# EAGLE design Talko_1_1 (EAGLE 7.2.0)
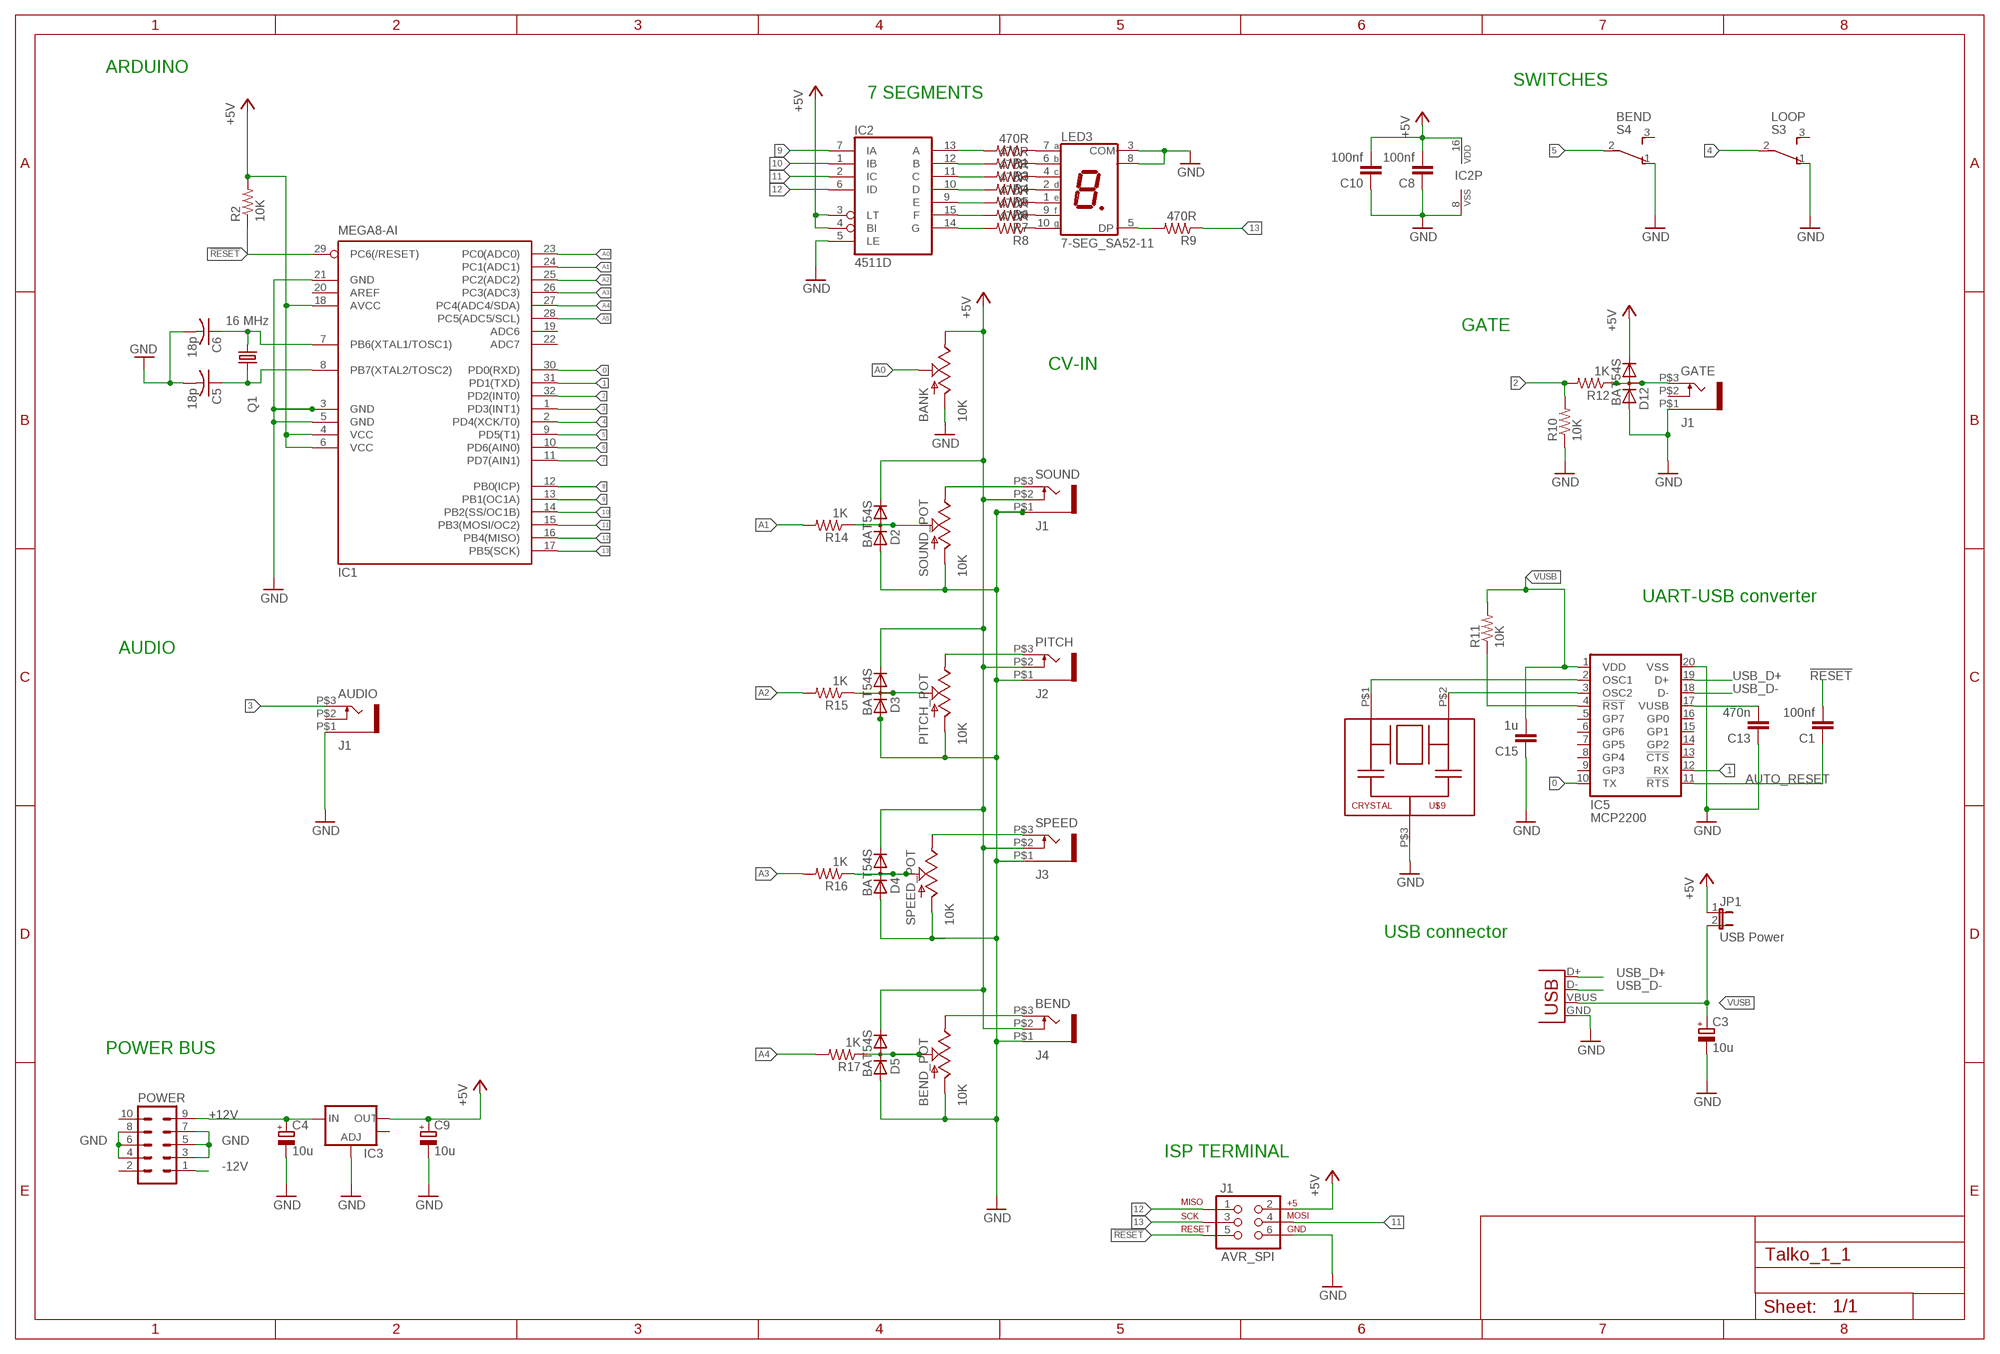
[diagram p0: schematic, sheet 1]

## Parts
AUDIO  J1  THONKICONN  [THONKICONN]
BANK  10K  POT  [ALPS_POT]
BEND  J4  THONKICONN  [THONKICONN]
BEND_POT  10K  POT  [ALPS_POT]
C1  100nf  C-EUC0805  [C0805]
C3  10u  CPOL-EUR/2012-12R  [R/2012-12R]
C4  10u  CPOL-EUR/2012-12R  [R/2012-12R]
C5  18p  C-USC0805K  [C0805K]
C6  18p  C-USC0805K  [C0805K]
C8  100nf  C-EUC0805  [C0805]
C9  10u  CPOL-EUR/2012-12R  [R/2012-12R]
C10  100nf  C-EUC0805  [C0805]
C13  470n  CAP0805  [0805]
C15  1u  CAP0805  [0805]
D2  BAT54S  DIODE_2CACA-SOT23  [SOT23]
D3  BAT54S  DIODE_2CACA-SOT23  [SOT23]
D4  BAT54S  DIODE_2CACA-SOT23  [SOT23]
D5  BAT54S  DIODE_2CACA-SOT23  [SOT23]
D12  BAT54S  DIODE_2CACA-SOT23  [SOT23]
GATE  J1  THONKICONN  [THONKICONN]
IC1  MEGA8-AI  [TQFP32-08]
IC2  4511D  [SO16]
IC3  V_REG_LM1117SOT223  [SOT223]
IC5  MCP2200  [SO20]
J1  AVR_SPI  AVR_SPI_PRG_62X3_LOCK  [2X3_LOCK]
JP1  USB Power  JP1E  [JP1]
LED3  7-SEG_SA52-11  [SA52-11]
PITCH  J2  THONKICONN  [THONKICONN]
PITCH_POT  10K  POT  [ALPS_POT]
POWER  10_PIN_HEADER  [MA05-2]
Q1  16 MHz  CRYSTALCTS406  [CTS406]
R1  470R  R-US_M0805  [M0805]
R2  10K  R-US_M0805  [M0805]
R3  470R  R-US_M0805  [M0805]
R4  470R  R-US_M0805  [M0805]
R5  470R  R-US_M0805  [M0805]
R6  470R  R-US_M0805  [M0805]
R7  470R  R-US_M0805  [M0805]
R8  470R  R-US_M0805  [M0805]
R9  470R  R-US_M0805  [M0805]
R10  10K  R-US_M0805  [M0805]
R11  10K  R-US_M0805  [M0805]
R12  1K  R-US_M0805  [M0805]
R14  1K  R-US_M0805  [M0805]
R15  1K  R-US_M0805  [M0805]
R16  1K  R-US_M0805  [M0805]
R17  1K  R-US_M0805  [M0805]
S3  LOOP  TL36PO  [TL3XPO]
S4  BEND  TL36PO  [TL3XPO]
SOUND  J1  THONKICONN  [THONKICONN]
SOUND_POT  10K  POT  [ALPS_POT]
SPEED  J3  THONKICONN  [THONKICONN]
SPEED_POT  10K  POT  [ALPS_POT]
U$9  CRYSTAL  [CRYSTAL]
X3  USB  USBPTH-VERTICAL  [USB-B-PTH-VERTICAL]

## Nets
0: IC1.30(PD0(RXD)) IC5.10(TX)
1: IC1.31(PD1(TXD)) IC5.12(RX)
2: IC1.32(PD2(INT0)) R10.2 R12.2
3: AUDIO.P$3 IC1.1(PD3(INT1))
4: IC1.2(PD4(XCK/T0)) S3.2(P)
5: IC1.9(PD5(T1)) S4.2(P)
6: IC1.10(PD6(AIN0))
7: IC1.11(PD7(AIN1))
8: IC1.12(PB0(ICP))
9: IC1.13(PB1(OC1A)) IC2.7(IA)
10: IC1.14(PB2(SS/OC1B)) IC2.1(IB)
11: IC1.15(PB3(MOSI/OC2)) IC2.2(IC) J1.4
12: IC1.16(PB4(MISO)) IC2.6(ID) J1.1
13: IC1.17(PB5(SCK)) J1.3 R9.1
!RESET: C1.2 IC1.29(PC6(/RESET)) J1.5 R2.1
+5V: BANK.P$1(E) BEND.P$2 C8.2 C9.+ C10.2 D2.2(C) D3.2(C) D4.2(C) D5.2(C) D12.2(C) IC1.4(VCC) IC1.6(VCC) IC1.18(AVCC) IC2.3(LT) IC2.4(BI) IC2.16(VDD) IC3.2(OUT) J1.2 JP1.1 PITCH.P$2 R2.2 SOUND.P$2 SPEED.P$2
+12V: C4.+ IC3.3(IN) POWER.9
-12V [power]: POWER.1
A0: BANK.P$2(S) IC1.23(PC0(ADC0))
A1: IC1.24(PC1(ADC1)) R14.2
A2: IC1.25(PC2(ADC2)) R15.2
A3: IC1.26(PC3(ADC3)) R16.2
A4: IC1.27(PC4(ADC4/SDA)) R17.2
A5: IC1.28(PC5(ADC5/SCL))
AUTO_RESET: C1.1 IC5.11(!RTS)
GND: AUDIO.P$1 BANK.P$3(A) BEND.P$1 BEND_POT.P$3(A) C3.- C4.- C5.2 C6.2 C8.1 C9.- C10.1 C13.1 C15.1 D2.1(A) D3.1(A) D4.1(A) D5.1(A) D12.1(A) GATE.P$1 IC1.3(GND) IC1.5(GND) IC1.21(GND) IC2.5(LE) IC2.8(VSS) IC3.1(ADJ) IC5.20(VSS) J1.6 LED3.3(COM) LED3.8(COM) PITCH.P$1 PITCH_POT.P$3(A) POWER.3 POWER.4 POWER.5 POWER.6 POWER.7 POWER.8 R10.1 S3.1(O) S4.1(O) SOUND.P$1 SOUND_POT.P$3(A) SPEED.P$1 SPEED_POT.P$3(A) U$9.P$3 X3.GND
N$1: D12.3(AC) GATE.P$3 R12.1
N$2: SOUND.P$3 SOUND_POT.P$1(E)
N$3: C5.1 IC1.8(PB7(XTAL2/TOSC2)) Q1.1
N$4: LED3.5(DP) R9.2
N$5: PITCH.P$3 PITCH_POT.P$1(E)
N$7: SPEED.P$3 SPEED_POT.P$1(E)
N$8: IC2.13(A) R1.2
N$9: D2.3(AC) R14.1 SOUND_POT.P$2(S)
N$10: LED3.7(A) R1.1
N$11: IC5.3(OSC2) U$9.P$2
N$12: C6.1 IC1.7(PB6(XTAL1/TOSC1)) Q1.3
N$15: IC2.12(B) R3.2
N$16: LED3.6(B) R3.1
N$17: IC2.11(C) R4.2
N$18: LED3.4(C) R4.1
N$19: IC2.10(D) R5.2
N$20: LED3.2(D) R5.1
N$21: IC2.9(E) R6.2
N$22: LED3.1(E) R6.1
N$23: IC2.15(F) R7.2
N$24: LED3.9(F) R7.1
N$25: IC2.14(G) R8.2
N$26: LED3.10(G) R8.1
N$27: IC5.2(OSC1) U$9.P$1
N$28: IC5.4(!RST) R11.1
N$29: C13.2 IC5.17(VUSB)
N$30: D4.3(AC) R16.1 SPEED_POT.P$2(S)
N$31: D3.3(AC) PITCH_POT.P$2(S) R15.1
N$33: BEND_POT.P$2(S) D5.3(AC) R17.1
N$36: BEND.P$3 BEND_POT.P$1(E)
USB_D+: IC5.19(D+) X3.D+
USB_D-: IC5.18(D-) X3.D-
VUSB: C3.+ C15.2 IC5.1(VDD) JP1.2 R11.2 X3.VBUS
Unconnected: AUDIO.P$2 GATE.P$2 IC1.19(ADC6) IC1.20(AREF) IC1.22(ADC7) IC3.4(OUT) IC5.5(GP7) IC5.6(GP6) IC5.7(GP5) IC5.8(GP4) IC5.9(GP3) IC5.13(!CTS) IC5.14(GP2) IC5.15(GP1) IC5.16(GP0) POWER.2 POWER.10 S3.3(S) S4.3(S)

## Notes on the sheet
- ARDUINO
- SWITCHES
- 7 SEGMENTS
- GATE
- CV-IN
- UART-USB converter
- AUDIO
- USB connector
- POWER BUS
- ISP TERMINAL

## Library data of the parts
AUDIO BEND GATE PITCH SOUND SPEED = thonkiconn:THONKICONN
BANK BEND_POT PITCH_POT SOUND_POT SPEED_POT = SparkFun-Electromechanical:POT; OC_FARNELL: 1769829; OC_MOUSER: 688-RK09L1140A2U
C1 C8 C10 = resistor:C-EU: CAPACITOR, European symbol; OC_MOUSER: 77-VJ0805V104MXBPBC
C3 C4 C9 = rcl:CPOL-EU: POLARIZED CAPACITOR, European symbol; OC_FARNELL: 1236657; OC_MOUSER: 581-F981C106MSAAS1
C5 C6 = rcl:C-US: CAPACITOR, American symbol; OC_MOUSER: 77-VJ0805A180GXQCBC
C13 = SparkFun:CAP: Capacitor Standard 0603 ceramic capacitor, and 0.1" leaded capacitor.; OC_FARNELL: 1457660; OC_MOUSER: 77-VJ0805Y474KXQTBC
C15 = SparkFun:CAP: Capacitor Standard 0603 ceramic capacitor, and 0.1" leaded capacitor.; OC_FARNELL: 2112910; OC_MOUSER: 77-VJ0805Y105KXQTBC
D2-D5 D12 = diode:DIODE_2CACA-: 2 Diodes - Cathode-Anode|Cathode-Anode; OC_MOUSER: 78-BAT54S-E3-08
IC1 = atmel:MEGA8: MICROCONTROLLER 8 Kbytes FLASH, 1 kbytes SRAM, 512 bytes EEPROM, USART, 6-channel 10 bit ADC, 2-channel 8 bit ADC Pin compatible with Atmega48, ATMega88, ATMega168 Source: avr.lbr; MPN: ATMEGA8-16AU; OC_FARNELL: 9171371; OC_MOUSER: 556-ATMEGA328P-AU; OC_NEWARK: 73M8863
IC2 = 45xx:4511: BCD to 7-segment LATCH/DECODER/DRIVER; OC_MOUSER: 863-MC14511BDG
IC3 = SparkFun-PowerIC:V_REG_LM1117: Voltage Regulator LM1117 Standard adjustable voltage regulator but in SMD form. Spark Fun Electronics SKU : COM-00595; OC_MOUSER: 621-AZ1117H-5.0TRE
IC5 = SteveMarple:MCP2200: MCP2200 Microchip USB-UART interface.; OC_FARNELL: 1781148; OC_MOUSER: 579-MCP2200-I/SO
J1 = SparkFun-Connectors:AVR_SPI_PRG_6: AVR ISP 6 Pin This is the reduced ISP connector for AVR programming. Common on Arduino. This footprint will take up less PCB space and can be used with a 10-pin to 6-pin adapter such as SKU: BOB-08508; OC_MOUSER: 571-826925-3
JP1 = jumper:JP1E: JUMPER; OC_MOUSER: 571-826646-2
LED3 = display-kingbright:7-SEG_: Kingbright 14.2mm (0.56 INCH) SINGLE DIGIT NUMERIC DUISPLAY Source: SA56-11EWA(Ver1189471036.pdf; OC_FARNELL: 1168602; OC_MOUSER: 604-SC52-11SRWA; OC_NEWARK: unknown
POWER = TomW:10_PIN_HEADER: PIN HEADER; OC_FARNELL: unknown; OC_MOUSER: 571-5-146258-5; OC_NEWARK: unknown
Q1 = crystal:CRYSTAL: CRYSTAL; OC_FARNELL: unknown; OC_MOUSER: 774-406C35S16M00000; OC_NEWARK: unknown
R1 R3-R9 = resistor:R-US_: RESISTOR, American symbol; OC_MOUSER: 754-RR1220P-471D
R2 R10 R11 = resistor:R-US_: RESISTOR, American symbol; OC_MOUSER: 754-RR1220P-103D
R12 R14-R17 = resistor:R-US_: RESISTOR, American symbol; OC_MOUSER: 71-TNPW08051K00BEEA
S3 S4 = switch:TL36PO: TINY SWITCH ON - ON Source: http://www2.produktinfo.conrad.com/datenblaetter/700000-724999/705152-da-01-de-Subminiaturschalter_TL_36YO.pdf; OC_FARNELL: 9472967; OC_MOUSER: 612-200ASP1T1A1M2R
U$9 = 57466:CRYSTAL; OC_FARNELL: 1218535; OC_MOUSER: 581-PBRC12.00HR50X
X3 = SteveMarple:USB: USB Connectors USB-B-PTH is fully proven SKU : PRT-00139 USB-miniB is fully proven SKU : PRT-00587 USB-A-PCB is untested. USB-A-H is throughly reviewed, but untested. Spark Fun Electronics SKU : PRT-00437 USB-B-SMT is throughly reviewed, but untested. Needs silkscreen touching up. USB-A-S has not been used/tested USB-MB-H has not been used/tested; OC_MOUSER: 855-M701-330442

## Net classes
0 default: width 0.254 mm
1 power: width 0.61 mm
2 ground: width 0.61 mm

## Board
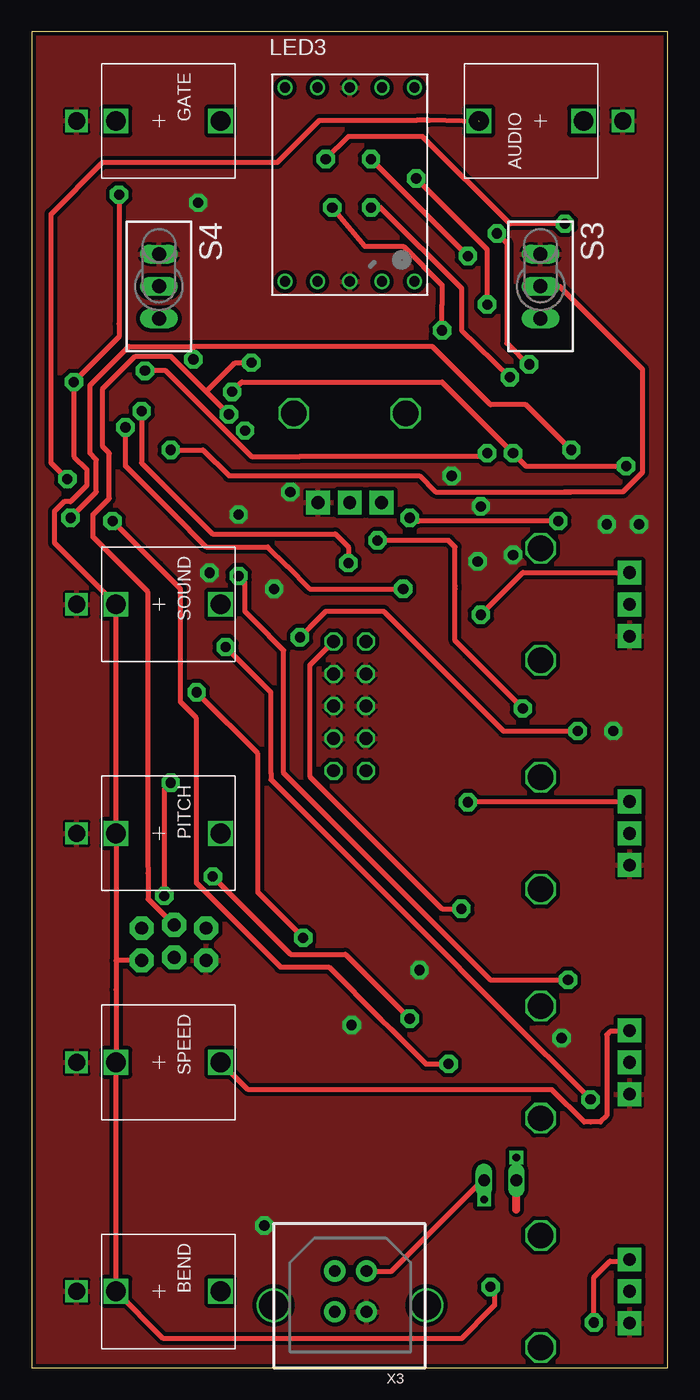
[diagram p1: board, top side]
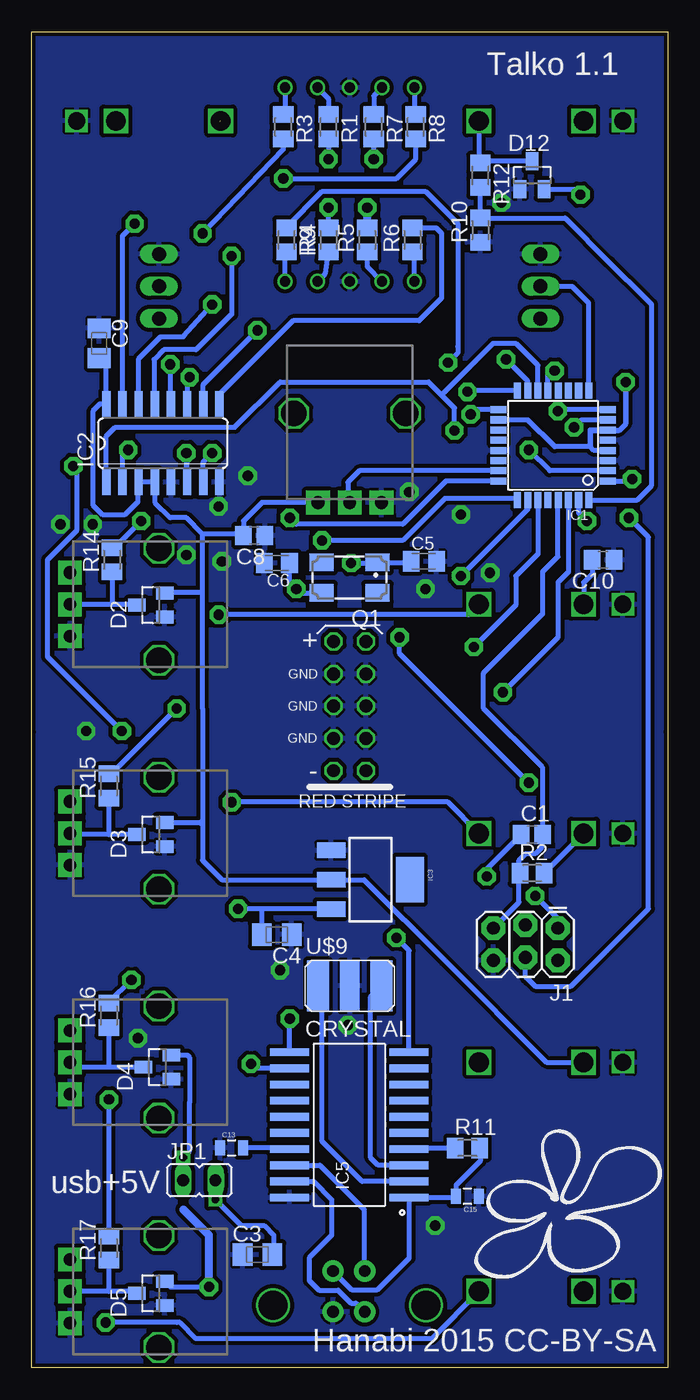
[diagram p2: board, bottom side, seen from below]

Size 50 x 105 mm. Coordinates in mm from the lower left corner, seen from the top.
Outline: 0,0 50,0 50,50 50,105 0,105 0,50 0,0
Copper layers (1*16): Top 0.035mm / dielectric 1.5mm / Bottom 0.035mm
Design rules "PCB-POOL Standard": minimum track width 0.15mm, minimum drill 0.3mm, track to track 0.15mm, track to pad 0.15mm, pad to pad 0.15mm, via to via 0.15mm, smd to smd 0.15mm, copper to edge 0.3mm, drill to drill 0.2mm, minimum pad ring 0.2mm, minimum via ring 0.15mm, stop-mask expansion 0.075mm, vias tented up to drill 0mil, thermal gap 0.2mm

### Footprints (pad centres in the part's own frame; a part is rotated, then mirrored left to right if it is on the bottom)
THONKICONN = drill 1.35 square: P$1 0,-6.48 | drill 1.55 square: P$2 0,-3.38; P$3 0,4.84
ALPS_POT = drill 1 pad 1.88 square: P$1 7,-2.5; P$2 7,0; P$3 7,2.5 | drill 2 octagon: P$4 0,-4.4; P$5 0,4.4
C0805 = smd 1.3 x 1.5: 1 -0.85,0; 2 0.85,0
R/2012-12R = smd 1.55 x 1.8: + 1.175,0; - -1.175,0
C0805K = smd 1.3 x 1.6: 1 -1,0; 2 1,0
0805 = smd 0.8 x 1.2: 1 -0.9,0; 2 0.9,0
SOT23 = smd 1 x 1.4: 1 -0.95,-1.1; 2 0.95,-1.1; 3 0,1.1
TQFP32-08 = smd 1.27 x 0.559: 1 -4.293,2.8; 2 -4.293,2; 3 -4.293,1.2; 4 -4.293,0.4; 5 -4.293,-0.4; 6 -4.293,-1.2; 7 -4.293,-2; 8 -4.293,-2.8; 17 4.293,-2.8; 18 4.293,-2; 19 4.293,-1.2; 20 4.293,-0.4; 21 4.293,0.4; 22 4.293,1.2; 23 4.293,2; 24 4.293,2.8 | smd 0.559 x 1.27: 9 -2.8,-4.293; 10 -2,-4.293; 11 -1.2,-4.293; 12 -0.4,-4.293; 13 0.4,-4.293; 14 1.2,-4.293; 15 2,-4.293; 16 2.8,-4.293; 25 2.8,4.293; 26 2,4.293; 27 1.2,4.293; 28 0.4,4.293; 29 -0.4,4.293; 30 -1.2,4.293; 31 -2,4.293; 32 -2.8,4.293
SO16 = smd 0.66 x 2.032: 1 -4.445,-3.073; 2 -3.175,-3.073; 3 -1.905,-3.073; 4 -0.635,-3.073; 5 0.635,-3.073; 6 1.905,-3.073; 7 3.175,-3.073; 8 4.445,-3.073; 9 4.445,3.073; 10 3.175,3.073; 11 1.905,3.073; 12 0.635,3.073; 13 -0.635,3.073; 14 -1.905,3.073; 15 -3.175,3.073; 16 -4.445,3.073
SOT223 = smd 1.219 x 2.235: 1 -2.311,-3.099; 2 0,-3.099; 3 2.311,-3.099 | smd 3.6 x 2.2: 4 0,3.099
SO20 = smd 0.61 x 3.048: 1 -5.715,-4.699; 2 -4.445,-4.699; 3 -3.175,-4.699; 4 -1.905,-4.699; 5 -0.635,-4.699; 6 0.635,-4.699; 7 1.905,-4.699; 8 3.175,-4.699; 9 4.445,-4.699; 10 5.715,-4.699; 11 5.715,4.699; 12 4.445,4.699; 13 3.175,4.699; 14 1.905,4.699; 15 0.635,4.699; 16 -0.635,4.699; 17 -1.905,4.699; 18 -3.175,4.699; 19 -4.445,4.699; 20 -5.715,4.699
2X3_LOCK = drill 1.016 pad 1.88 octagon: 1 0,0; 2 0,2.54; 3 2.54,-0.254; 4 2.54,2.286; 5 5.08,0; 6 5.08,2.54
JP1 = drill 0.914 long: 1 0,-1.27; 2 0,1.27
SA52-11 = drill 0.8: 1 -5.08,-7.62; 2 -2.54,-7.62; 3 0,-7.62; 4 2.54,-7.62; 5 5.08,-7.62; 6 5.08,7.62; 7 2.54,7.62; 8 0,7.62; 9 -2.54,7.62; 10 -5.08,7.62
MA05-2 = drill 1.016 octagon: 1 -5.08,-1.27; 2 -5.08,1.27; 3 -2.54,-1.27; 4 -2.54,1.27; 5 0,-1.27; 6 0,1.27; 7 2.54,-1.27; 8 2.54,1.27; 9 5.08,-1.27; 10 5.08,1.27
CTS406 = smd 1.9 x 1.4: 1 -2.2,-1.2; 2 2.2,-1.2; 3 2.2,1.2; 4 -2.2,1.2
M0805 = smd 1.3 x 1.6: 1 -0.95,0; 2 0.95,0
TL3XPO = drill 1.1 pad 1.422 long: 1 -2.54,0; 2 0,0; 3 2.54,0
CRYSTAL = smd 1.7 x 4: P$1 -2.5,0; P$2 2.5,0 | smd 1.5 x 4: P$3 0,0
USB-B-PTH-VERTICAL = drill 0.914 pad 1.676: D+ 4.826,4.394; D- 4.826,7.595; GND 7.315,4.394; VBUS 7.315,7.595 | drill 2.286: P$1 0,4.902; P$2 12.04,4.902

### Placement (x,y rotation side)
AUDIO  40,98 90 top
BANK  25,75 270 bottom
BEND  10,6 270 top
BEND_POT  40,6 180 bottom
C1  10.67,41.91 0 bottom
C3  32.26,8.89 0 bottom
C4  30.73,34.04 180 bottom
C5  19.18,63.37 0 bottom
C6  30.73,63.25 180 bottom
C8  32.51,65.41 180 bottom
C9  44.7,80.52 270 bottom
C10  5.08,63.5 180 bottom
C13  34.29,17.27 0 bottom
C15  15.75,13.46 180 bottom
D2  40.64,59.94 90 bottom
D3  40.64,41.91 90 bottom
D4  40.13,23.62 90 bottom
D5  40.64,5.84 90 bottom
D12  10.67,93.73 0 bottom
GATE  10,98 270 top
IC1  9.01,72.5 180 bottom
IC2  39.69,72.67 0 bottom
IC3  23.37,38.35 270 bottom
IC5  25.04,19.08 90 bottom
J1  8.64,34.54 180 bottom
JP1  36.83,14.73 270 bottom
LED3  25,93 0 top
PITCH  10,42 270 top
PITCH_POT  40,42 180 bottom
POWER  25,52 90 bottom
Q1  25.02,62.1 180 bottom
R1  26.67,97.54 270 bottom
R2  10.67,38.86 0 bottom
R3  30.23,97.54 270 bottom
R4  26.67,88.65 90 bottom
R5  23.62,88.65 90 bottom
R6  20.07,88.65 90 bottom
R7  23.11,97.54 270 bottom
R8  19.81,97.54 270 bottom
R9  29.97,88.65 270 bottom
R10  14.73,89.41 90 bottom
R11  15.75,17.27 0 bottom
R12  14.73,93.73 270 bottom
R14  43.69,63.5 90 bottom
R15  43.94,45.72 90 bottom
R16  43.94,27.69 90 bottom
R17  43.94,9.4 90 bottom
S3  40,85 270 top
S4  10,85 270 top
SOUND  10,60 270 top
SOUND_POT  40,60 180 bottom
SPEED  10,24 270 top
SPEED_POT  40,24 180 bottom
U$1  [LOGO_HANABI]  16.51,6.35 0 bottom
U$9  25,30 0 bottom
X3  19,0 0 top

### Tracks (layer width: path | path; a pad name or v marks a point on that pad's centre or on a via)
0  (via drill 0.8)
  Top 0.406: v12.95,53.09 13.21,52.83 17.78,48.26 17.78,37.34 21.08,34.04 v21.34,33.78
  Bottom 0.406: IC1.30 7.81,65.47 7.81,62.55 8.64,61.72 8.64,57.4 v12.95,53.09 | IC5.10 20.34,32.78 v21.34,33.78
1  (via drill 0.8)
  Top 0.406: 11.68,61.21 11.56,61.34 | 11.56,61.34 9.91,62.99 v6.35,66.55 | 11.68,61.21 11.68,52.32 12.95,51.05 12.95,42.93 12.95,38.1 13.72,37.34 17.53,33.53 19.56,31.5 23.37,31.5 27.43,27.43 28.19,26.67 30.99,23.88 v32.77,23.88 | 11.68,61.21 11.56,61.34
  Bottom 0.406: IC1.31 7.01,67.21 v6.35,66.55 | IC5.12 32.42,23.53 v32.77,23.88
2
  Bottom 0.406: R12.2 R10.2 8.06,90.36 4.57,86.87 1.78,84.07 1.27,83.57 1.27,78.99 1.27,69.34 2.41,68.2 IC1.32
3  (via drill 0.8)  (1 unrouted)
  Top 0.406: v2.79,69.85 1.52,71.12 1.52,90.68 5.59,94.74 19.3,94.74 22.61,98.04 30.23,98.04 31.24,98.04 35.18,97.92 35.05,97.92
  Bottom 0.406: IC1.1 2.95,69.7 v2.79,69.85
4  (via drill 0.8)
  Top 0.406: S3.2 41.49,85 43.94,82.55 48.01,78.49 48.01,70.36 46.48,68.83 41.91,68.83 | v10.92,72.14 13.46,72.14 15.49,70.1 30.48,70.1 31.75,68.83 41.91,68.83 | 41.91,68.83 42.42,68.83
  Bottom 0.406: IC1.2 9.28,70.5 v10.92,72.14
5
  Bottom 0.406: S4.2 7.53,85 6.35,83.82 6.21,83.68 IC1.9
9  (via drill 0.8)
  Top 0.406: v35.81,71.88 35.56,71.63 21.08,71.63 17.27,71.63 16,72.9 10.54,78.36 v8.89,78.36
  Bottom 0.406: IC2.7 36.52,71.18 v35.81,71.88 | IC1.13 9.41,78.22 v8.89,78.36
10  (via drill 0.8)
  Bottom 0.406: IC2.1 44.13,73.21 43.43,73.91 34.04,73.91 30.48,77.47 18.8,77.47 17.78,76.45 | 17.78,76.45 16.76,75.44 | v16.76,73.66 16.76,74.17 16.76,75.44 | 16.76,75.44 17.78,76.45 | 17.78,76.45 13.72,80.52 11.94,80.52 11.43,80.01 10.21,78.79 IC1.14
11  (via drill 0.8)
  Top 0.406: v42.42,72.14 42.16,72.39 41.4,73.15 38.86,75.69 36.07,75.69 31.5,80.26 16,80.26 12.7,80.26 | v3.05,66.8 4.32,68.07 5.08,68.83 5.08,71.37 4.57,71.88 4.57,77.22 4.83,77.47 7.62,80.26 12.7,80.26 | v12.7,79.25 12.7,80.26
  Bottom 0.406: IC2.2 42.87,71.69 v42.42,72.14 | v3.05,66.8 1.52,65.28 1.52,36.07 7.62,29.97 10.41,29.97 10.92,30.48 11.18,30.73 J1.4 | IC1.15 11.01,77.56 v12.7,79.25
12  (via drill 0.8)
  Top 0.406: v37.85,71.88 36.58,73.15 | 36.58,73.15 v37.85,71.88 | 36.58,73.15 v37.85,71.88 | v37.85,71.88 38.86,70.87 | 38.86,70.87 46.48,70.87 | 46.48,70.87 v46.74,70.87 | 36.58,73.15 v37.85,71.88 | v37.85,71.88 38.86,70.87 | 38.86,70.87 46.48,70.87 | 46.48,70.87 v46.74,70.87 | v21.08,57.4 21.84,58.17 23.11,59.44 27.69,59.44 37.08,50.04 40.89,50.04 41.15,50.04 v42.93,50.04 | v10.92,45.97 10.41,45.47 v10.41,37.08 | v15.75,76.71 16.51,77.47 32.26,77.47 36.58,73.15 | v37.85,71.88 38.86,70.87 | 38.86,70.87 v46.74,70.87
  Bottom 0.406: IC1.16 15.41,76.79 v15.75,76.71 | 46.48,70.61 v46.74,70.87 46.48,70.61 | 46.48,70.61 46.48,65.79 | v10.41,37.08 8.64,35.31 J1.1 | v10.92,45.97 21.08,56.13 v21.08,57.4 | 46.48,70.61 46.48,65.79 | 46.48,65.79 48.77,63.5 48.77,55.88 v42.93,50.04 | IC2.6 37.78,71.18 v37.85,71.88 37.85,69.66 IC2.6
13  (via drill 0.8)
  Top 0.406: v15.49,74.93 14.48,75.95 13.72,76.71 | 13.72,76.71 16,78.99 v17.27,78.99 | 13.72,76.71 13.46,76.96 12.45,77.98 10.92,79.5 8.13,79.5 5.59,76.96 5.59,72.39 6.1,71.88 6.1,68.33 4.83,67.06 4.83,65.28 7.62,62.48 9.14,60.96 9.14,39.37 9.14,38.86 9.14,36.83 J1.3
  Bottom 0.406: R9.1 29.97,89.66 27.18,92.46 19.05,92.46 16.51,89.92 16.51,80.26 16.51,79.76 v17.27,78.99 | IC1.17 15.13,75.3 | 15.13,75.3 v15.49,74.93 15.13,75.3
!RESET
  Bottom 0.406: J1.5 11.68,36.58 11.68,38.35 11.68,38.8 R2.1 11.68,38.93 11.68,39.88 11.18,40.39 10.67,40.39 10.41,40.39 9.91,40.89 9.91,41.82 C1.2 9.82,47.16 9.91,47.24 14.48,51.82 14.48,54.61 9.82,59.27 9.82,62.57 8.64,63.75 8.64,68.18 IC1.29
+5V  (via drill 0.6, 0.8)
  Top 0.406: 6.62,32 PITCH.P$2 SOUND.P$2 1.78,64.84 1.78,67.31 2.54,68.07 3.05,68.07 4.32,69.34 4.32,70.61 3.3,71.63 v3.3,77.47 6.86,81.03 6.86,82.04 v6.86,92.2 | 6.62,32 6.62,29.72 6.62,24.64 BEND.P$2 10.33,2.29 33.78,2.29 36.07,4.57 36.39,4.89 36.39,6.03 v36.07,6.35 | 38.1,12.45 JP1.1 v38.1,16.51 | J1.2 6.62,32
  Top 0.61: 6.62,24.64 SPEED.P$2 | 38.1,12.45 JP1.1
  Bottom 0.406: C9.+ 44.45,79.6 44.45,79.76 44.13,79.56 IC2.16 44.66,75.74 45.21,75.18 45.21,67.82 44.45,67.06 42.67,67.06 41.66,68.07 41.66,69.53 IC2.3 IC2.4 40.33,68.01 39.12,66.8 37.85,66.8 36.58,65.53 | 38.1,12.45 36.07,10.41 v36.07,6.35 39.1,6.35 D5.2 | R2.2 6.62,41.96 PITCH.P$2 | D12.2 7.28,92.63 v6.86,92.2 | SPEED.P$2 9.52,24 17.53,32 23.88,38.35 IC3.2 35.05,38.35 35.18,38.48 36.58,39.88 36.58,42.67 | BANK.P$1 31.91,68 33.36,66.55 C8.2 | 6.1,73.7 IC1.6 4.68,73.66 3.81,73.66 | IC1.4 5.8,72.1 | 5.8,72.1 6.1,72.39 | 6.1,72.39 6.1,73.44 6.1,73.66 | 6.1,73.66 6.1,73.7 | 3.3,74.17 v3.3,77.47 3.3,74.17 | 3.3,74.17 3.81,73.66 | C10.2 5.93,62.4 6.6,61.72 6.6,60.02 SOUND.P$2 | 5.8,72.1 6.1,72.39 | 6.1,72.39 6.1,73.66 | 6.1,73.66 3.81,73.66 | 3.81,73.66 3.3,74.17 | 6.1,73.7 6.1,72.39 | 6.1,72.39 8.89,72.39 11,74.5 IC1.18 | v38.1,16.51 37.59,17.02 37.59,20.83 37.59,24.38 37.78,24.57 D4.2 | 33.27,65.49 C8.2 | C8.2 33.49,65.53 35.05,65.53 35.81,65.53 36.58,65.53 | 36.58,42.67 36.58,51.82 36.58,60.96 | D3.2 36.76,42.86 36.58,42.67 | 36.58,60.96 36.58,65.02 36.58,65.53 | D2.2 39.47,60.96 36.58,60.96
  Bottom 0.61: v36.07,6.35 36.07,10.41 38.1,12.45
+12V  (via drill 0.8)
  Top 0.406: POWER.9 21.84,55.19 21.84,46.48 32.26,36.07 v33.78,36.07
  Bottom 0.406: IC3.3 32,36.04 | 32,36.04 33.76,36.04 v33.78,36.07 | C4.+ 31.91,35.95 32,36.04
A0
  Bottom 0.406: IC1.23 24.24,70.5 25.15,69.6 25.15,68.15 BANK.P$2
A1  (via drill 0.8)
  Top 0.406: v41.4,66.55 30.48,66.55 29.97,66.55 v29.72,66.8
  Bottom 0.406: 43.75,64.7 R14.2 43.69,64.26 v41.4,66.55 | IC1.24 17.42,69.7 20.83,66.29 29.21,66.29 v29.72,66.8
A2  (via drill 0.8)
  Top 0.406: v27.18,65.02 32.77,65.02 33.27,64.52 33.27,61.47 33.27,61.21 33.27,57.15 34.29,56.13 v38.61,51.82
  Bottom 0.406: IC1.25 11.93,68.33 17.53,68.33 20.83,65.02 v27.18,65.02 | v38.61,51.82 43.75,46.67 R15.2
A3  (via drill 0.8)
  Top 0.406: v16.26,62.23 16.76,61.72 16.76,61.21 16.76,59.44 17.53,58.67 19.81,56.39 19.81,46.74 36.07,30.48 42.1,30.48 | 42.1,30.48 42.16,30.67 42.1,30.48 | 42.1,30.48 v42.16,30.48
  Bottom 0.406: IC1.26 11.01,67.48 v16.26,62.23 | v42.16,30.48 43.94,28.7 R16.2
A4  (via drill 0.8)
  Top 0.406: v43.94,21.08 37.08,27.94 30.23,34.8 18.8,46.23 18.8,46.74 18.8,53.09 v15.24,56.64
  Bottom 0.406: IC1.27 10.21,63.96 11.94,62.23 11.94,59.94 v15.24,56.64 | v43.94,21.08 R17.2
AUTO_RESET  (via drill 0.8)
  Top 0.406: v14.22,38.61 20.34,32.49 24.66,32.49 v29.72,27.43
  Bottom 0.406: v14.22,38.61 14.22,39.2 C1.1 | IC5.11 29.74,27.41 v29.72,27.43
GND  (via drill 0.8)
  other vias: 25.15,26.92 13.08,91.57 30.48,31.24 41.66,25.91 18.29,11.18 37.85,63.88 45.72,50.04 47.75,66.29 33.02,70.1 13.97,62.48 20.32,68.83 16.26,67.06 35.31,67.69 45.21,66.29 19.05,61.21 35.05,63.37
  pour Top (isolate 0.305): 0,106.68 50.04,106.68 50.04,0 0,0
  pour Bottom (isolate 0.305): 0,105.66 49.78,105.66 50.04,0 0,0
N$1
  Bottom 0.406: D12.3 14.33,94.83 R12.1 14.84,94.53 GATE.P$3
N$2  (via drill 0.8)
  Top 0.406: v35.31,59.18 38.62,62.5 SOUND_POT.P$1
  Bottom 0.406: SOUND.P$3 15.66,59.18 v35.31,59.18
N$3  (via drill 0.8)
  Top 0.406: v8.64,75.18 8.64,71.12 14.22,65.53 23.88,65.53 24.38,65.02 24.89,64.52 v24.89,63.25
  Bottom 0.406: IC1.8 8.52,75.3 v8.64,75.18 | v24.89,63.25 22.88,63.25 Q1.1 20.36,63.3 C5.1
N$4
  Bottom 0.406: LED3.5 30.08,87.7 R9.2
N$5  (via drill 0.8)
  Top 0.406: v34.29,44.45 34.34,44.5 PITCH_POT.P$1
  Bottom 0.406: 46.95,44.45 PITCH_POT.P$1 | PITCH.P$3 17.29,44.45 v34.29,44.45
N$7
  Top 0.406: SPEED_POT.P$1 46.92,26.42 45.47,26.42 45.21,26.16 45.21,19.81 44.7,19.3 43.94,19.3 43.43,19.3 40.89,21.84 17.02,21.84 14.86,24 SPEED.P$3
N$8  (via drill 0.8)
  Top 0.406: v26.67,95 v34.29,87.38
  Bottom 0.406: R1.2 v26.67,95 | v34.29,87.38 34.29,82.8 37.08,80.01 39.62,80.01 40.39,79.25 40.39,75.8 IC2.13
N$9
  Bottom 0.406: D2.3 41.94,60 43.69,60 | 43.69,60 SOUND_POT.P$2 | R14.1 43.69,60
N$10
  Bottom 0.406: LED3.7 26.67,99.75 R1.1
N$11
  Bottom 0.406: IC5.3 22.77,15.91 23.37,16.51 23.37,29.13 U$9.P$2
N$12  (via drill 0.8)
  Top 0.406: v7.37,73.91 7.37,70.87 11.04,67.2 13.72,64.52 18.54,64.52 20.07,62.99 21.84,61.21 v29.21,61.21
  Bottom 0.406: IC1.7 6.78,74.5 v7.37,73.91 | C6.1 29.73,61.74 v29.21,61.21 28.9,60.9 Q1.3
N$15  (via drill 0.8)
  Top 0.406: v36.58,89.15 37.34,88.39 37.34,80.52 39.12,78.74 v39.12,78.87
  Bottom 0.406: R3.2 30.23,95.76 v36.58,89.15 | v39.12,78.87 39.12,75.8 IC2.12
N$16
  Bottom 0.406: LED3.6 30.08,98.49 R3.1
N$17  (via drill 0.8)
  Top 0.406: v26.67,91.19 27.43,91.19 33.78,84.84 33.78,81.53 v37.59,77.85
  Bottom 0.406: R4.2 v26.67,91.19 | v37.59,77.85 37.78,77.78 IC2.11
N$18
  Bottom 0.406: LED3.4 26.92,86 R4.1
N$19  (via drill 0.8)
  Top 0.406: v23.62,91.19 26.16,88.14 29.21,88.14 32.26,85.09 32.26,83.57 v32.26,81.53
  Bottom 0.406: R5.2 v23.62,91.19 | IC2.10 36.52,77.28 v32.26,81.53
  Bottom 0.61: R5.2 v23.62,91.19
N$20
  Bottom 0.406: LED3.2 23.62,86.54 R5.1
N$21
  Bottom 0.406: R6.2 18.22,89.6 17.78,89.15 17.78,84.07 19.56,82.3 29.46,82.3 35.31,76.45 35.31,75.8 IC2.9
N$22
  Bottom 0.406: LED3.1 19.92,87.7 R6.1
N$23  (via drill 0.8)
  Top 0.406: v41.91,89.92 37.59,89.92 30.73,96.77 24.89,96.77 v23.11,95
  Bottom 0.406: IC2.15 42.87,88.96 v41.91,89.92 | v23.11,95 R7.2
N$24
  Bottom 0.406: LED3.9 23.11,99.97 R7.1
N$25  (via drill 0.8)
  Top 0.406: v35.81,83.57 35.81,87.88 v30.23,93.47
  Bottom 0.406: IC2.14 41.59,79.31 39.88,81.03 38.1,81.03 v35.81,83.57 | v30.23,93.47 21.34,93.47 19.81,95 R8.2
N$26
  Bottom 0.406: LED3.10 19.92,98.49 R8.1
N$27
  Bottom 0.406: IC5.2 24.04,14.64 27.18,17.78 27.18,30.35 | 27.18,30.35 27.18,30.48 | U$9.P$1 27.5,30.03 27.18,30.35
N$28
  Bottom 0.406: IC5.4 20.25,17.27 R11.1
N$29
  Bottom 0.406: IC5.17 29.83,17.27 C13.2
N$30
  Bottom 0.406: D4.3 43.94,23.62 | 43.94,23.62 46.62,23.62 SPEED_POT.P$2 | R16.1 43.94,23.62
N$31
  Bottom 0.406: D3.3 43.94,41.91 | 43.94,41.91 46.91,41.91 PITCH_POT.P$2 | R15.1 43.94,41.91
N$33
  Bottom 0.406: D5.3 41.9,6 43.94,6 | 43.94,6 BEND_POT.P$2 | R17.1 43.94,6
N$36  (via drill 0.8)
  Top 0.406: v44.2,3.56 44.2,7.11 45.47,8.38 46.88,8.38 BEND_POT.P$1
  Bottom 0.406: BEND.P$3 18.55,2.29 37.08,2.29 38.35,3.56 38.61,3.56 v44.2,3.56
USB_D+
  Bottom 0.406: IC5.19 27.85,14.64 26.42,13.21 26.42,10.41 28.19,8.64 28.19,6.86 27.43,6.1 25.91,6.1 24.89,5.08 24.51,5.08 X3.D+
USB_D-
  Bottom 0.406: IC5.18 27.34,15.91 23.88,12.45 23.88,7.64 X3.D-
VUSB  (via drill 0.6)
  Top 0.406: JP1.2 v35.56,13.21 | X3.VBUS 28.29,7.59 v35.43,14.73
  Bottom 0.406: R11.2 14.73,17.21 14.73,16.26 16.65,14.34 C15.2 16.74,13.37 IC5.1 20.34,8.62 22.86,6.1 24.82,6.1 X3.VBUS | v35.56,13.21 33.53,11.18 31.75,11.18 30.99,10.41 30.99,8.98 C3.+ | v35.43,14.73 JP1.2

### Text on the board
bNames: Talko 1.1 | usb+5V | Hanabi 2015 CC-BY-SA